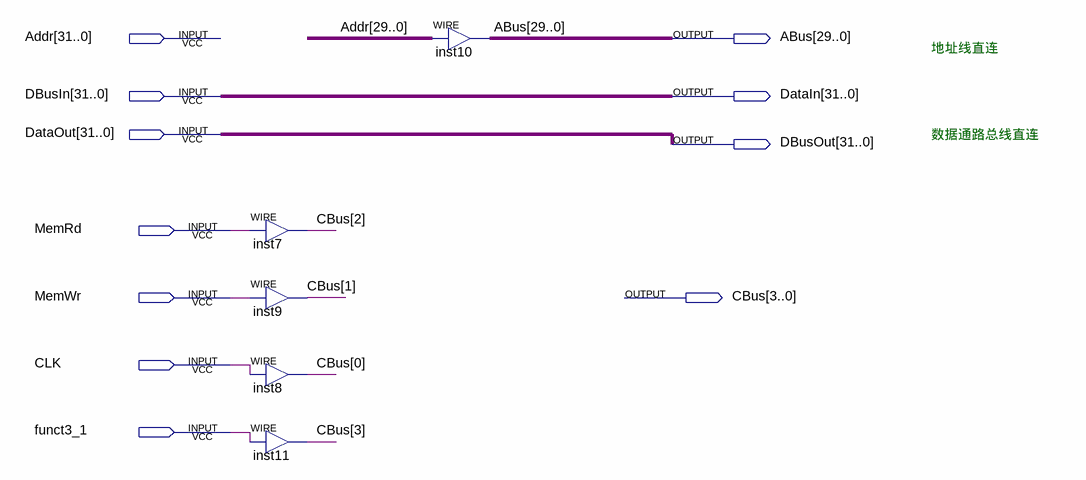
[diagram p0: schematic sheet]
// Quartus schematic DBIU.bdf as structural Verilog: 5 symbols, 11 pins
module DBIU (
  input  [31:0] Addr,
  input  [31:0] DBusIn,
  input  [31:0] DataOut,
  input  MemRd,
  input  MemWr,
  input  CLK,
  input  funct3_1,
  output [29:0] ABus,
  output [31:0] DataIn,
  output [31:0] DBusOut,
  output [3:0] CBus
);

  assign CBus[2] = MemRd;  // WIRE inst7
  assign CBus[1] = MemWr;  // WIRE inst9
  assign CBus[0] = CLK;  // WIRE inst8
  assign CBus[3] = funct3_1;  // WIRE inst11
  assign ABus = Addr[29:0];  // WIRE inst10

  assign DataIn = DBusIn;
  assign DBusOut = DataOut;

  // Notes on the sheet:
  //   地址线直连
  //   数据通路总线直连
endmodule
